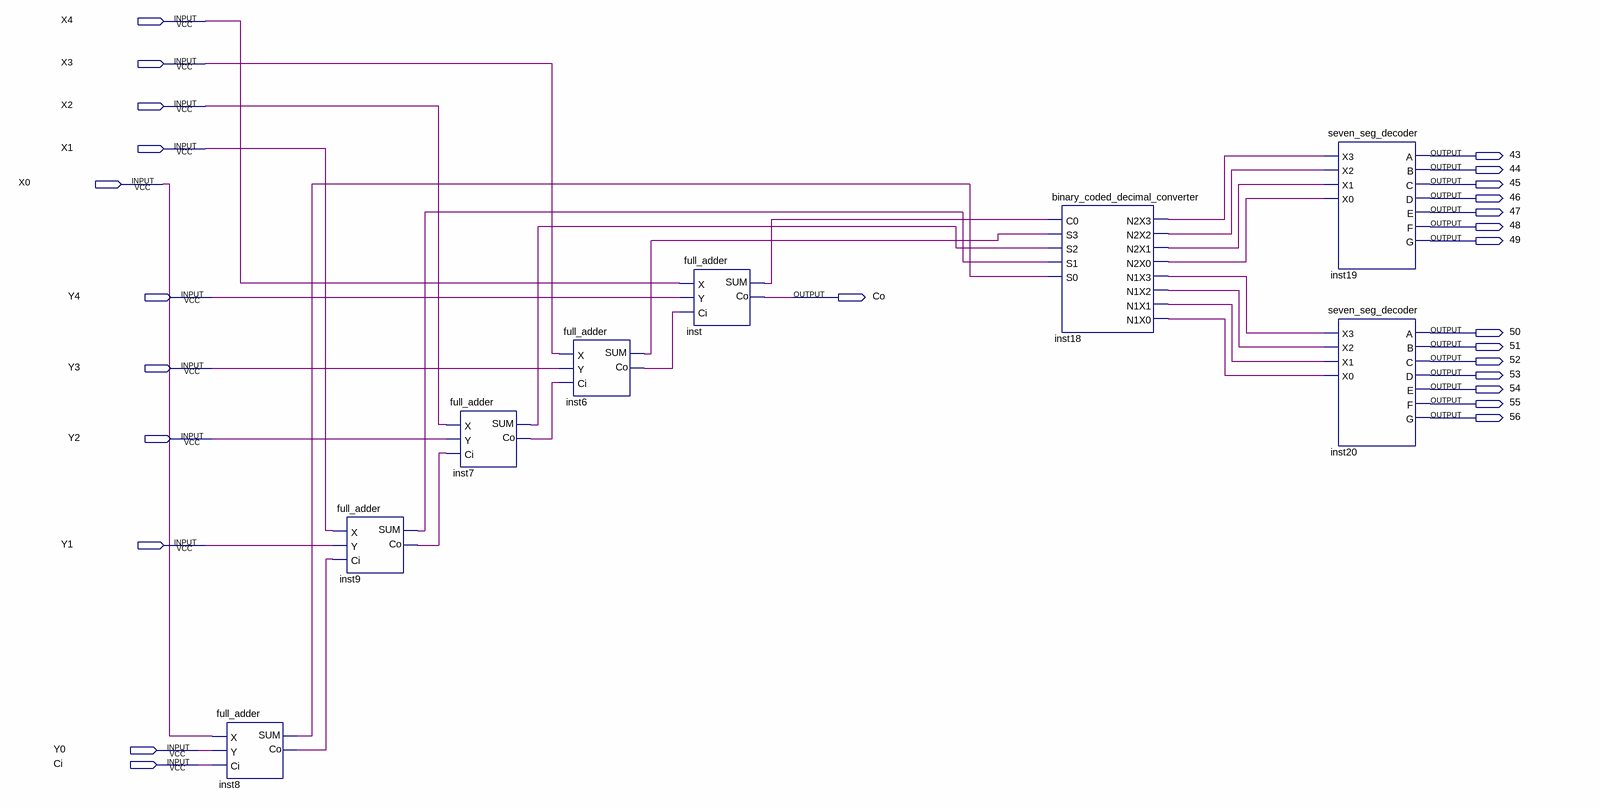
[diagram p0: schematic sheet]
// Quartus schematic adder_5bit.bdf as structural Verilog: 8 symbols, 26 pins
module adder_5bit (
  input  X4,
  input  X3,
  input  X2,
  input  X1,
  input  X0,
  input  Y4,
  input  Y3,
  input  Y2,
  input  Y1,
  input  Y0,
  input  Ci,
  output \43 ,
  output \44 ,
  output \45 ,
  output \46 ,
  output \47 ,
  output \48 ,
  output \49 ,
  output Co,
  output \50 ,
  output \51 ,
  output \52 ,
  output \53 ,
  output \54 ,
  output \55 ,
  output \56 
);

  wire inst6_co, inst6_sum, inst7_co, inst7_sum, inst8_co, inst8_sum, inst9_co, inst9_sum, inst18_n1x0,
       inst18_n1x1, inst18_n1x2, inst18_n1x3, inst18_n2x0, inst18_n2x1, inst18_n2x2, inst18_n2x3, inst_sum;

  full_adder inst8 (.X(X0), .Y(Y0), .Ci(Ci), .SUM(inst8_sum), .Co(inst8_co));
  full_adder inst9 (.X(X1), .Y(Y1), .Ci(inst8_co), .SUM(inst9_sum), .Co(inst9_co));
  full_adder inst7 (.X(X2), .Y(Y2), .Ci(inst9_co), .SUM(inst7_sum), .Co(inst7_co));
  full_adder inst6 (.X(X3), .Y(Y3), .Ci(inst7_co), .SUM(inst6_sum), .Co(inst6_co));
  full_adder inst (.X(X4), .Y(Y4), .Ci(inst6_co), .SUM(inst_sum), .Co(Co));
  binary_coded_decimal_converter inst18 (
    .C0(inst_sum), .S3(inst6_sum), .S2(inst7_sum), .S1(inst9_sum), .S0(inst8_sum), .N2X3(inst18_n2x3),
    .N2X2(inst18_n2x2), .N2X1(inst18_n2x1), .N2X0(inst18_n2x0), .N1X3(inst18_n1x3), .N1X2(inst18_n1x2),
    .N1X1(inst18_n1x1), .N1X0(inst18_n1x0));
  seven_seg_decoder inst19 (
    .X3(inst18_n2x3), .X2(inst18_n2x2), .X1(inst18_n2x1), .X0(inst18_n2x0), .A(\43 ), .B(\44 ), .C(\45 ),
    .D(\46 ), .E(\47 ), .F(\48 ), .G(\49 ));
  seven_seg_decoder inst20 (
    .X3(inst18_n1x3), .X2(inst18_n1x2), .X1(inst18_n1x1), .X0(inst18_n1x0), .A(\50 ), .B(\51 ), .C(\52 ),
    .D(\53 ), .E(\54 ), .F(\55 ), .G(\56 ));
endmodule
